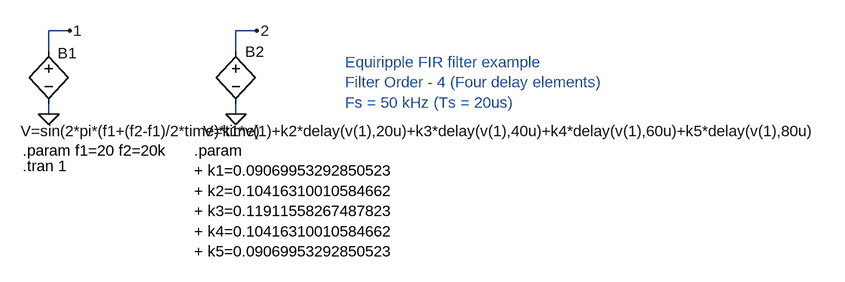
[diagram p0: schematic FIR_Filter_B-Source.asc]
FIR_Filter_B-Source.asc, the LTspice schematic file:
Version 4
SHEET 1 2124 700
WIRE 144 176 112 176
WIRE 432 176 400 176
WIRE 112 208 112 176
WIRE 400 208 400 176
WIRE 112 304 112 288
WIRE 400 304 400 288
FLAG 112 304 0
FLAG 400 304 0
FLAG 432 176 2
FLAG 144 176 1
SYMBOL bv 112 192 R0
WINDOW 0 14 18 Left 0
WINDOW 3 -43 138 Left 0
SYMATTR InstName B1
SYMATTR Value V=sin(2*pi*(f1+(f2-f1)/2*time)*time)
SYMBOL bv 400 192 R0
WINDOW 0 14 16 Left 0
WINDOW 3 -50 138 Left 0
SYMATTR InstName B2
SYMATTR Value V=k1*v(1)+k2*delay(v(1),20u)+k3*delay(v(1),40u)+k4*delay(v(1),60u)+k5*delay(v(1),80u)
TEXT 72 384 Left 0 !.tran 1
TEXT 336 360 Left 0 !.param\n+ k1=0.09069953292850523\n+ k2=0.10416310010584662\n+ k3=0.11911558267487823\n+ k4=0.10416310010584662\n+ k5=0.09069953292850523
TEXT 568 224 Left 0 ;Equiripple FIR filter example\nFilter Order - 4 (Four delay elements)\nFs = 50 kHz (Ts = 20us)
TEXT 72 360 Left 0 !.param f1=20 f2=20k

The netlist it stands for:
* FIR_Filter_B-Source.asc
B1 1 0 V=sin(2*pi*(f1+(f2-f1)/2*time)*time)
B2 2 0 V=k1*v(1)+k2*delay(v(1),20u)+k3*delay(v(1),40u)+k4*delay(v(1),60u)+k5*delay(v(1),80u)
.tran 1
.param
+ k1=0.09069953292850523
+ k2=0.10416310010584662
+ k3=0.11911558267487823
+ k4=0.10416310010584662
+ k5=0.09069953292850523
* Equiripple FIR filter example
* Filter Order - 4 (Four delay elements)
* Fs = 50 kHz (Ts = 20us)
.param f1=20 f2=20k
.backanno
.end